# Altium schematic sheet SENSOR.SchDoc
size A; SheetNumber: 1; SheetTotal: 3
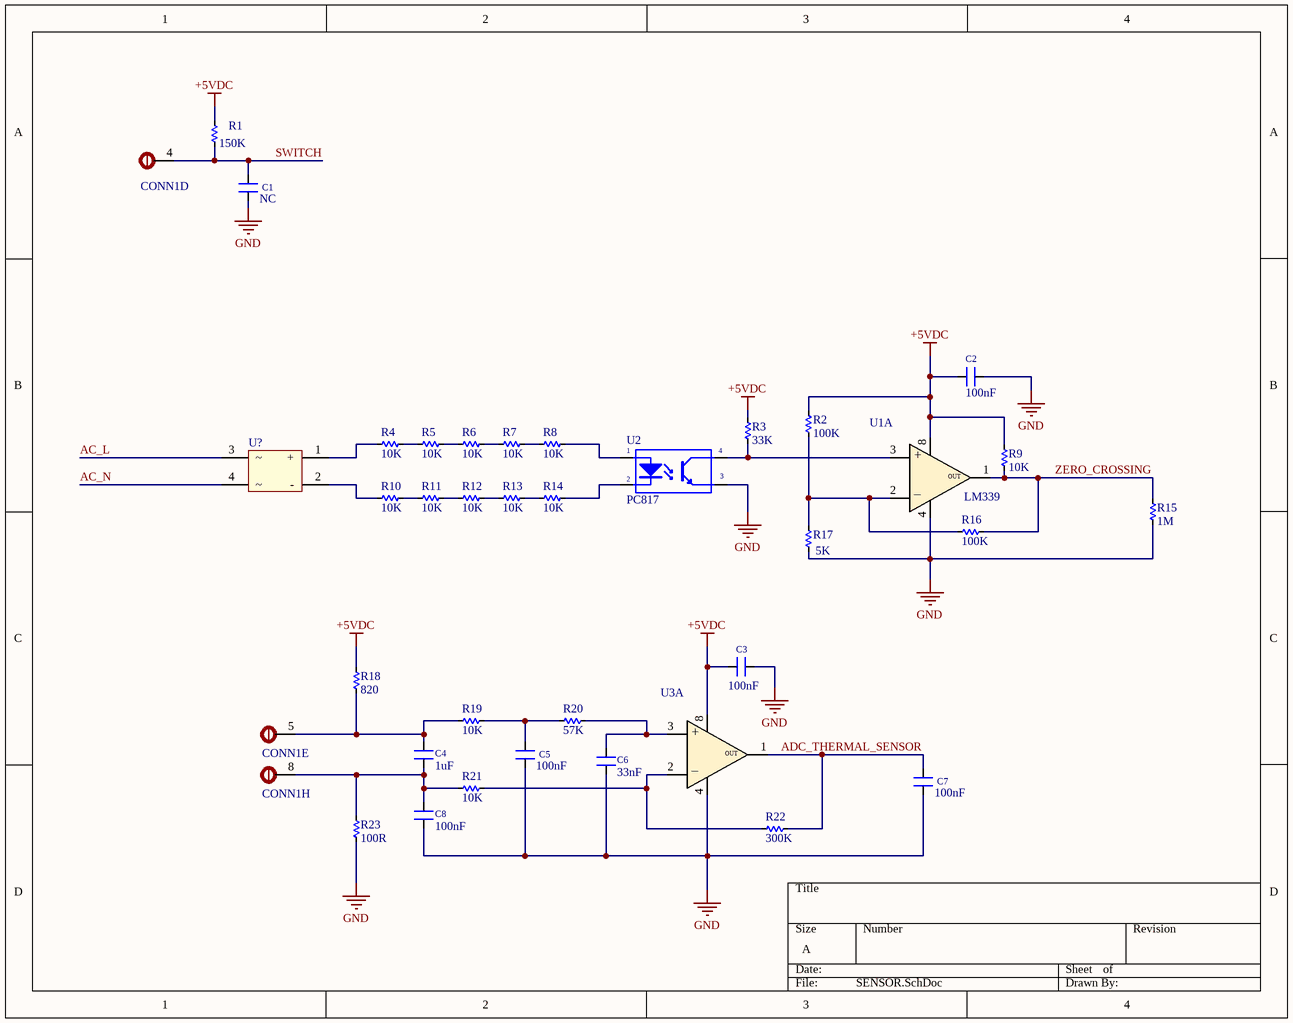
[diagram p0: SENSOR.SchDoc]

## Parts
C1  NC  [SM-CAP-0805]
C2  100nF  [SM-CAP-0805]
C3  100nF  [SM-CAP-0805]
C4  1uF  [SM-CAP-0805]
C5  100nF  [SM-CAP-0805]
C6  33nF  [SM-CAP-0805]
C7  100nF  [SM-CAP-0805]
C8  100nF  [SM-CAP-0805]
CONN1  GX-16 CONNECTOR  [GX-16]  (value not drawn)  (parts D,E,H of 8)
R1  150K  [RES-SMD-0603]
R2  100K  [RES-SMD-0805]
R3  33K  [RES-SMD-0603]
R4  10K  [RES-SMD-0805]
R5  10K  [RES-SMD-0805]
R6  10K  [RES-SMD-0805]
R7  10K  [RES-SMD-0805]
R8  10K  [RES-SMD-0805]
R9  10K  [RES-SMD-0805]
R10  10K  [RES-SMD-0805]
R11  10K  [RES-SMD-0805]
R12  10K  [RES-SMD-0805]
R13  10K  [RES-SMD-0805]
R14  10K  [RES-SMD-0805]
R15  1M  [RES-SMD-0805]
R16  100K  [RES-SMD-0805]
R17  5K  [RES-SMD-0805]
R18  820  [RES-SMD-0603]
R19  10K  [RES-SMD-0603]
R20  57K  [RES-SMD-0603]
R21  10K  [RES-SMD-0603]
R22  300K  [RES-SMD-0603]
R23  100R  [RES-SMD-0603]
U1  LM339  [SOP-8]  (part A of 2)
U2  PC817  [PC817]
U3  MCP6002  [SOP-8]  (value not drawn)  (part A of 2)
U?  (no value)  [Diode Bridge SMD]

## Nets
+5VDC: C2.2 C3.2 R1.1 R2.1 R3.1 R9.2 R18.1 U1.8 U3.8
GND: C1.1 C2.1 C3.1 C5.1 C6.1 C7.1 C8.1 R15.1 R17.2 R23.2 U1.4 U2.3(E) U3.4
AC_L: U?.3
AC_N: U?.4
ADC_THERMAL_SENSOR: C7.2 R22.1 U3.1
SWITCH: C1.2 CONN1.4 R1.2
ZERO_CROSSING: R9.1 R15.2 R16.2 U1.1
NetC4_1: C4.1 C8.2 CONN1.8 R21.2 R23.1
NetC4_2: C4.2 CONN1.5 R18.2 R19.2
NetC5_2: C5.2 R19.1 R20.2
NetC6_2: C6.2 R20.1 U3.3
NetR2_2: R2.2 R16.1 R17.1 U1.2
NetR3_2: R3.2 U1.3 U2.4(C)
NetR4_1: R4.1 R5.2
NetR4_2: R4.2 U?.1(+)
NetR5_1: R5.1 R6.2
NetR6_1: R6.1 R7.2
NetR7_1: R7.1 R8.2
NetR8_1: R8.1 U2.1(A)
NetR10_1: R10.1 R11.2
NetR10_2: R10.2 U?.2(-)
NetR11_1: R11.1 R12.2
NetR12_1: R12.1 R13.2
NetR13_1: R13.1 R14.2
NetR14_1: R14.1 U2.2(K)
NetR21_1: R21.1 R22.2 U3.2

## Notes on the sheet
- (in symbol MCP6002, part A) +; OUT; _

## Library data of the parts
C1-C8 = CAP SMD: Value: 0,1uF/300V; Designed by: VanDungEvn
R1-R23 = Res-SMD: Resistor; Manufacturer: Generic Components; Class: Passive; Published: 08/06/2000; Publisher: Altium Hobart Technology Centre
U1 = MCP6002
U2 = PC817: Single Opto; Value: PC817
U? = Diode Bridge smd 1A: Diode Bridge